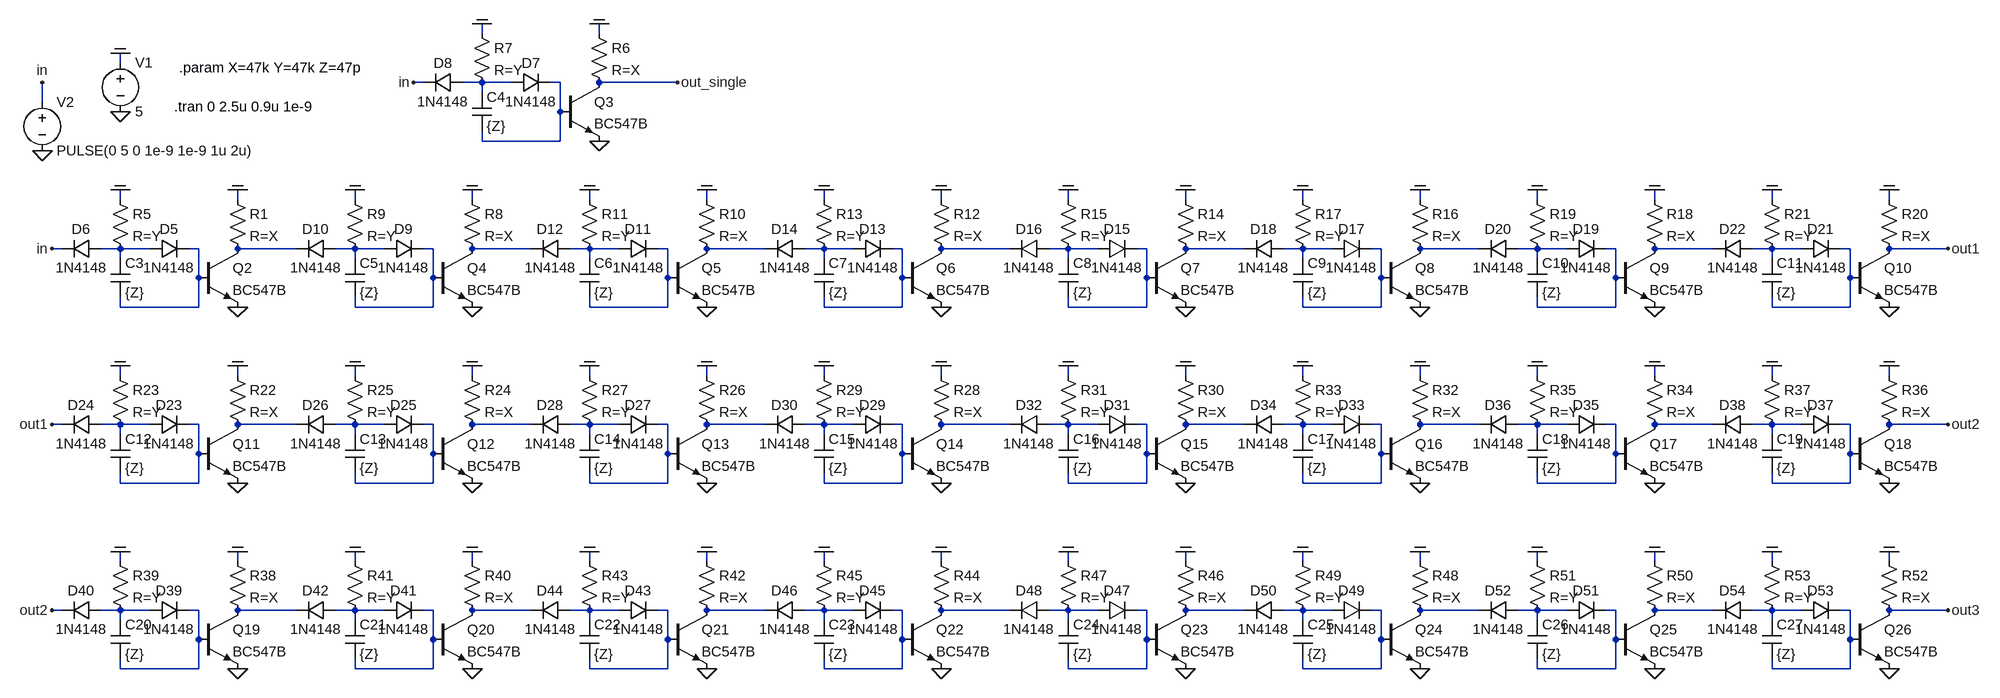
[diagram p0: schematic dtl_cap.asc]
dtl_cap.asc, the LTspice schematic file:
Version 4
SHEET 1 2948 1300
WIRE 480 240 480 224
WIRE 672 240 672 224
WIRE -112 288 -112 272
WIRE 384 320 368 320
WIRE 480 320 448 320
WIRE 528 320 480 320
WIRE 608 320 592 320
WIRE 800 320 672 320
WIRE 480 336 480 320
WIRE -240 352 -240 320
WIRE 608 368 608 320
WIRE 480 416 480 400
WIRE 608 416 608 368
WIRE 608 416 480 416
WIRE -112 512 -112 496
WIRE 80 512 80 496
WIRE 272 512 272 496
WIRE 464 512 464 496
WIRE 656 512 656 496
WIRE 848 512 848 496
WIRE 1040 512 1040 496
WIRE 1232 512 1232 496
WIRE 1440 512 1440 496
WIRE 1632 512 1632 496
WIRE 1824 512 1824 496
WIRE 2016 512 2016 496
WIRE 2208 512 2208 496
WIRE 2400 512 2400 496
WIRE 2592 512 2592 496
WIRE 2784 512 2784 496
WIRE -208 592 -224 592
WIRE -112 592 -144 592
WIRE -64 592 -112 592
WIRE 16 592 0 592
WIRE 176 592 80 592
WIRE 272 592 240 592
WIRE 320 592 272 592
WIRE 400 592 384 592
WIRE 560 592 464 592
WIRE 656 592 624 592
WIRE 704 592 656 592
WIRE 784 592 768 592
WIRE 944 592 848 592
WIRE 1040 592 1008 592
WIRE 1088 592 1040 592
WIRE 1168 592 1152 592
WIRE 1344 592 1232 592
WIRE 1440 592 1408 592
WIRE 1488 592 1440 592
WIRE 1568 592 1552 592
WIRE 1728 592 1632 592
WIRE 1824 592 1792 592
WIRE 1872 592 1824 592
WIRE 1952 592 1936 592
WIRE 2112 592 2016 592
WIRE 2208 592 2176 592
WIRE 2256 592 2208 592
WIRE 2336 592 2320 592
WIRE 2496 592 2400 592
WIRE 2592 592 2560 592
WIRE 2640 592 2592 592
WIRE 2720 592 2704 592
WIRE 2880 592 2784 592
WIRE -112 608 -112 592
WIRE 272 608 272 592
WIRE 656 608 656 592
WIRE 1040 608 1040 592
WIRE 1440 608 1440 592
WIRE 1824 608 1824 592
WIRE 2208 608 2208 592
WIRE 2592 608 2592 592
WIRE 16 640 16 592
WIRE 400 640 400 592
WIRE 784 640 784 592
WIRE 1168 640 1168 592
WIRE 1568 640 1568 592
WIRE 1952 640 1952 592
WIRE 2336 640 2336 592
WIRE 2720 640 2720 592
WIRE -112 688 -112 672
WIRE 16 688 16 640
WIRE 16 688 -112 688
WIRE 272 688 272 672
WIRE 400 688 400 640
WIRE 400 688 272 688
WIRE 656 688 656 672
WIRE 784 688 784 640
WIRE 784 688 656 688
WIRE 1040 688 1040 672
WIRE 1168 688 1168 640
WIRE 1168 688 1040 688
WIRE 1440 688 1440 672
WIRE 1568 688 1568 640
WIRE 1568 688 1440 688
WIRE 1824 688 1824 672
WIRE 1952 688 1952 640
WIRE 1952 688 1824 688
WIRE 2208 688 2208 672
WIRE 2336 688 2336 640
WIRE 2336 688 2208 688
WIRE 2592 688 2592 672
WIRE 2720 688 2720 640
WIRE 2720 688 2592 688
WIRE -112 800 -112 784
WIRE 80 800 80 784
WIRE 272 800 272 784
WIRE 464 800 464 784
WIRE 656 800 656 784
WIRE 848 800 848 784
WIRE 1040 800 1040 784
WIRE 1232 800 1232 784
WIRE 1440 800 1440 784
WIRE 1632 800 1632 784
WIRE 1824 800 1824 784
WIRE 2016 800 2016 784
WIRE 2208 800 2208 784
WIRE 2400 800 2400 784
WIRE 2592 800 2592 784
WIRE 2784 800 2784 784
WIRE -208 880 -224 880
WIRE -112 880 -144 880
WIRE -64 880 -112 880
WIRE 16 880 0 880
WIRE 176 880 80 880
WIRE 272 880 240 880
WIRE 320 880 272 880
WIRE 400 880 384 880
WIRE 560 880 464 880
WIRE 656 880 624 880
WIRE 704 880 656 880
WIRE 784 880 768 880
WIRE 944 880 848 880
WIRE 1040 880 1008 880
WIRE 1088 880 1040 880
WIRE 1168 880 1152 880
WIRE 1344 880 1232 880
WIRE 1440 880 1408 880
WIRE 1488 880 1440 880
WIRE 1568 880 1552 880
WIRE 1728 880 1632 880
WIRE 1824 880 1792 880
WIRE 1872 880 1824 880
WIRE 1952 880 1936 880
WIRE 2112 880 2016 880
WIRE 2208 880 2176 880
WIRE 2256 880 2208 880
WIRE 2336 880 2320 880
WIRE 2496 880 2400 880
WIRE 2592 880 2560 880
WIRE 2640 880 2592 880
WIRE 2720 880 2704 880
WIRE 2880 880 2784 880
WIRE -112 896 -112 880
WIRE 272 896 272 880
WIRE 656 896 656 880
WIRE 1040 896 1040 880
WIRE 1440 896 1440 880
WIRE 1824 896 1824 880
WIRE 2208 896 2208 880
WIRE 2592 896 2592 880
WIRE 16 928 16 880
WIRE 400 928 400 880
WIRE 784 928 784 880
WIRE 1168 928 1168 880
WIRE 1568 928 1568 880
WIRE 1952 928 1952 880
WIRE 2336 928 2336 880
WIRE 2720 928 2720 880
WIRE -112 976 -112 960
WIRE 16 976 16 928
WIRE 16 976 -112 976
WIRE 272 976 272 960
WIRE 400 976 400 928
WIRE 400 976 272 976
WIRE 656 976 656 960
WIRE 784 976 784 928
WIRE 784 976 656 976
WIRE 1040 976 1040 960
WIRE 1168 976 1168 928
WIRE 1168 976 1040 976
WIRE 1440 976 1440 960
WIRE 1568 976 1568 928
WIRE 1568 976 1440 976
WIRE 1824 976 1824 960
WIRE 1952 976 1952 928
WIRE 1952 976 1824 976
WIRE 2208 976 2208 960
WIRE 2336 976 2336 928
WIRE 2336 976 2208 976
WIRE 2592 976 2592 960
WIRE 2720 976 2720 928
WIRE 2720 976 2592 976
WIRE -112 1104 -112 1088
WIRE 80 1104 80 1088
WIRE 272 1104 272 1088
WIRE 464 1104 464 1088
WIRE 656 1104 656 1088
WIRE 848 1104 848 1088
WIRE 1040 1104 1040 1088
WIRE 1232 1104 1232 1088
WIRE 1440 1104 1440 1088
WIRE 1632 1104 1632 1088
WIRE 1824 1104 1824 1088
WIRE 2016 1104 2016 1088
WIRE 2208 1104 2208 1088
WIRE 2400 1104 2400 1088
WIRE 2592 1104 2592 1088
WIRE 2784 1104 2784 1088
WIRE -208 1184 -224 1184
WIRE -112 1184 -144 1184
WIRE -64 1184 -112 1184
WIRE 16 1184 0 1184
WIRE 176 1184 80 1184
WIRE 272 1184 240 1184
WIRE 320 1184 272 1184
WIRE 400 1184 384 1184
WIRE 560 1184 464 1184
WIRE 656 1184 624 1184
WIRE 704 1184 656 1184
WIRE 784 1184 768 1184
WIRE 944 1184 848 1184
WIRE 1040 1184 1008 1184
WIRE 1088 1184 1040 1184
WIRE 1168 1184 1152 1184
WIRE 1344 1184 1232 1184
WIRE 1440 1184 1408 1184
WIRE 1488 1184 1440 1184
WIRE 1568 1184 1552 1184
WIRE 1728 1184 1632 1184
WIRE 1824 1184 1792 1184
WIRE 1872 1184 1824 1184
WIRE 1952 1184 1936 1184
WIRE 2112 1184 2016 1184
WIRE 2208 1184 2176 1184
WIRE 2256 1184 2208 1184
WIRE 2336 1184 2320 1184
WIRE 2496 1184 2400 1184
WIRE 2592 1184 2560 1184
WIRE 2640 1184 2592 1184
WIRE 2720 1184 2704 1184
WIRE 2880 1184 2784 1184
WIRE -112 1200 -112 1184
WIRE 272 1200 272 1184
WIRE 656 1200 656 1184
WIRE 1040 1200 1040 1184
WIRE 1440 1200 1440 1184
WIRE 1824 1200 1824 1184
WIRE 2208 1200 2208 1184
WIRE 2592 1200 2592 1184
WIRE 16 1232 16 1184
WIRE 400 1232 400 1184
WIRE 784 1232 784 1184
WIRE 1168 1232 1168 1184
WIRE 1568 1232 1568 1184
WIRE 1952 1232 1952 1184
WIRE 2336 1232 2336 1184
WIRE 2720 1232 2720 1184
WIRE -112 1280 -112 1264
WIRE 16 1280 16 1232
WIRE 16 1280 -112 1280
WIRE 272 1280 272 1264
WIRE 400 1280 400 1232
WIRE 400 1280 272 1280
WIRE 656 1280 656 1264
WIRE 784 1280 784 1232
WIRE 784 1280 656 1280
WIRE 1040 1280 1040 1264
WIRE 1168 1280 1168 1232
WIRE 1168 1280 1040 1280
WIRE 1440 1280 1440 1264
WIRE 1568 1280 1568 1232
WIRE 1568 1280 1440 1280
WIRE 1824 1280 1824 1264
WIRE 1952 1280 1952 1232
WIRE 1952 1280 1824 1280
WIRE 2208 1280 2208 1264
WIRE 2336 1280 2336 1232
WIRE 2336 1280 2208 1280
WIRE 2592 1280 2592 1264
WIRE 2720 1280 2720 1232
WIRE 2720 1280 2592 1280
FLAG -112 368 0
FLAG -112 272 COM
FLAG -240 432 0
FLAG -240 320 in
FLAG 80 688 0
FLAG 80 496 COM
FLAG -112 496 COM
FLAG 672 416 0
FLAG 672 224 COM
FLAG 480 224 COM
FLAG 464 688 0
FLAG 464 496 COM
FLAG 272 496 COM
FLAG 848 688 0
FLAG 848 496 COM
FLAG 656 496 COM
FLAG 1232 688 0
FLAG 1232 496 COM
FLAG 1040 496 COM
FLAG 1632 688 0
FLAG 1632 496 COM
FLAG 1440 496 COM
FLAG 2016 688 0
FLAG 2016 496 COM
FLAG 1824 496 COM
FLAG 2400 688 0
FLAG 2400 496 COM
FLAG 2208 496 COM
FLAG 2784 688 0
FLAG 2784 496 COM
FLAG 2592 496 COM
FLAG 80 976 0
FLAG 80 784 COM
FLAG -112 784 COM
FLAG 464 976 0
FLAG 464 784 COM
FLAG 272 784 COM
FLAG 848 976 0
FLAG 848 784 COM
FLAG 656 784 COM
FLAG 1232 976 0
FLAG 1232 784 COM
FLAG 1040 784 COM
FLAG 1632 976 0
FLAG 1632 784 COM
FLAG 1440 784 COM
FLAG 2016 976 0
FLAG 2016 784 COM
FLAG 1824 784 COM
FLAG 2400 976 0
FLAG 2400 784 COM
FLAG 2208 784 COM
FLAG 2784 976 0
FLAG 2784 784 COM
FLAG 2592 784 COM
FLAG 80 1280 0
FLAG 80 1088 COM
FLAG -112 1088 COM
FLAG 464 1280 0
FLAG 464 1088 COM
FLAG 272 1088 COM
FLAG 848 1280 0
FLAG 848 1088 COM
FLAG 656 1088 COM
FLAG 1232 1280 0
FLAG 1232 1088 COM
FLAG 1040 1088 COM
FLAG 1632 1280 0
FLAG 1632 1088 COM
FLAG 1440 1088 COM
FLAG 2016 1280 0
FLAG 2016 1088 COM
FLAG 1824 1088 COM
FLAG 2400 1280 0
FLAG 2400 1088 COM
FLAG 2208 1088 COM
FLAG 2784 1280 0
FLAG 2784 1088 COM
FLAG 2592 1088 COM
FLAG -224 592 in
FLAG 2880 592 out1
FLAG -224 880 out1
FLAG 2880 880 out2
FLAG -224 1184 out2
FLAG 2880 1184 out3
FLAG 368 320 in
FLAG 800 320 out_single
SYMBOL voltage -112 272 R0
WINDOW 123 0 0 Left 2
WINDOW 39 0 0 Left 2
SYMATTR InstName V1
SYMATTR Value 5
SYMBOL voltage -240 336 R0
WINDOW 123 0 0 Left 2
WINDOW 39 0 0 Left 2
SYMATTR InstName V2
SYMATTR Value PULSE(0 5 0 1e-9 1e-9 1u 2u)
SYMBOL npn 16 592 R0
SYMATTR InstName Q2
SYMATTR Value BC547B
SYMBOL res 64 496 R0
SYMATTR InstName R1
SYMATTR Value R=X
SYMBOL diode -64 608 R270
WINDOW 0 32 32 VTop 2
WINDOW 3 0 32 VBottom 2
SYMATTR InstName D5
SYMATTR Value 1N4148
SYMBOL diode -144 576 R90
WINDOW 0 0 32 VBottom 2
WINDOW 3 32 32 VTop 2
SYMATTR InstName D6
SYMATTR Value 1N4148
SYMBOL res -128 496 R0
SYMATTR InstName R5
SYMATTR Value R=Y
SYMBOL cap -128 608 R0
SYMATTR InstName C3
SYMATTR Value {Z}
SYMBOL npn 608 320 R0
SYMATTR InstName Q3
SYMATTR Value BC547B
SYMBOL res 656 224 R0
SYMATTR InstName R6
SYMATTR Value R=X
SYMBOL diode 528 336 R270
WINDOW 0 32 32 VTop 2
WINDOW 3 0 32 VBottom 2
SYMATTR InstName D7
SYMATTR Value 1N4148
SYMBOL diode 448 304 R90
WINDOW 0 0 32 VBottom 2
WINDOW 3 32 32 VTop 2
SYMATTR InstName D8
SYMATTR Value 1N4148
SYMBOL res 464 224 R0
SYMATTR InstName R7
SYMATTR Value R=Y
SYMBOL cap 464 336 R0
SYMATTR InstName C4
SYMATTR Value {Z}
SYMBOL npn 400 592 R0
SYMATTR InstName Q4
SYMATTR Value BC547B
SYMBOL res 448 496 R0
SYMATTR InstName R8
SYMATTR Value R=X
SYMBOL diode 320 608 R270
WINDOW 0 32 32 VTop 2
WINDOW 3 0 32 VBottom 2
SYMATTR InstName D9
SYMATTR Value 1N4148
SYMBOL diode 240 576 R90
WINDOW 0 0 32 VBottom 2
WINDOW 3 32 32 VTop 2
SYMATTR InstName D10
SYMATTR Value 1N4148
SYMBOL res 256 496 R0
SYMATTR InstName R9
SYMATTR Value R=Y
SYMBOL cap 256 608 R0
SYMATTR InstName C5
SYMATTR Value {Z}
SYMBOL npn 784 592 R0
SYMATTR InstName Q5
SYMATTR Value BC547B
SYMBOL res 832 496 R0
SYMATTR InstName R10
SYMATTR Value R=X
SYMBOL diode 704 608 R270
WINDOW 0 32 32 VTop 2
WINDOW 3 0 32 VBottom 2
SYMATTR InstName D11
SYMATTR Value 1N4148
SYMBOL diode 624 576 R90
WINDOW 0 0 32 VBottom 2
WINDOW 3 32 32 VTop 2
SYMATTR InstName D12
SYMATTR Value 1N4148
SYMBOL res 640 496 R0
SYMATTR InstName R11
SYMATTR Value R=Y
SYMBOL cap 640 608 R0
SYMATTR InstName C6
SYMATTR Value {Z}
SYMBOL npn 1168 592 R0
SYMATTR InstName Q6
SYMATTR Value BC547B
SYMBOL res 1216 496 R0
SYMATTR InstName R12
SYMATTR Value R=X
SYMBOL diode 1088 608 R270
WINDOW 0 32 32 VTop 2
WINDOW 3 0 32 VBottom 2
SYMATTR InstName D13
SYMATTR Value 1N4148
SYMBOL diode 1008 576 R90
WINDOW 0 0 32 VBottom 2
WINDOW 3 32 32 VTop 2
SYMATTR InstName D14
SYMATTR Value 1N4148
SYMBOL res 1024 496 R0
SYMATTR InstName R13
SYMATTR Value R=Y
SYMBOL cap 1024 608 R0
SYMATTR InstName C7
SYMATTR Value {Z}
SYMBOL npn 1568 592 R0
SYMATTR InstName Q7
SYMATTR Value BC547B
SYMBOL res 1616 496 R0
SYMATTR InstName R14
SYMATTR Value R=X
SYMBOL diode 1488 608 R270
WINDOW 0 32 32 VTop 2
WINDOW 3 0 32 VBottom 2
SYMATTR InstName D15
SYMATTR Value 1N4148
SYMBOL diode 1408 576 R90
WINDOW 0 0 32 VBottom 2
WINDOW 3 32 32 VTop 2
SYMATTR InstName D16
SYMATTR Value 1N4148
SYMBOL res 1424 496 R0
SYMATTR InstName R15
SYMATTR Value R=Y
SYMBOL cap 1424 608 R0
SYMATTR InstName C8
SYMATTR Value {Z}
SYMBOL npn 1952 592 R0
SYMATTR InstName Q8
SYMATTR Value BC547B
SYMBOL res 2000 496 R0
SYMATTR InstName R16
SYMATTR Value R=X
SYMBOL diode 1872 608 R270
WINDOW 0 32 32 VTop 2
WINDOW 3 0 32 VBottom 2
SYMATTR InstName D17
SYMATTR Value 1N4148
SYMBOL diode 1792 576 R90
WINDOW 0 0 32 VBottom 2
WINDOW 3 32 32 VTop 2
SYMATTR InstName D18
SYMATTR Value 1N4148
SYMBOL res 1808 496 R0
SYMATTR InstName R17
SYMATTR Value R=Y
SYMBOL cap 1808 608 R0
SYMATTR InstName C9
SYMATTR Value {Z}
SYMBOL npn 2336 592 R0
SYMATTR InstName Q9
SYMATTR Value BC547B
SYMBOL res 2384 496 R0
SYMATTR InstName R18
SYMATTR Value R=X
SYMBOL diode 2256 608 R270
WINDOW 0 32 32 VTop 2
WINDOW 3 0 32 VBottom 2
SYMATTR InstName D19
SYMATTR Value 1N4148
SYMBOL diode 2176 576 R90
WINDOW 0 0 32 VBottom 2
WINDOW 3 32 32 VTop 2
SYMATTR InstName D20
SYMATTR Value 1N4148
SYMBOL res 2192 496 R0
SYMATTR InstName R19
SYMATTR Value R=Y
SYMBOL cap 2192 608 R0
SYMATTR InstName C10
SYMATTR Value {Z}
SYMBOL npn 2720 592 R0
SYMATTR InstName Q10
SYMATTR Value BC547B
SYMBOL res 2768 496 R0
SYMATTR InstName R20
SYMATTR Value R=X
SYMBOL diode 2640 608 R270
WINDOW 0 32 32 VTop 2
WINDOW 3 0 32 VBottom 2
SYMATTR InstName D21
SYMATTR Value 1N4148
SYMBOL diode 2560 576 R90
WINDOW 0 0 32 VBottom 2
WINDOW 3 32 32 VTop 2
SYMATTR InstName D22
SYMATTR Value 1N4148
SYMBOL res 2576 496 R0
SYMATTR InstName R21
SYMATTR Value R=Y
SYMBOL cap 2576 608 R0
SYMATTR InstName C11
SYMATTR Value {Z}
SYMBOL npn 16 880 R0
SYMATTR InstName Q11
SYMATTR Value BC547B
SYMBOL res 64 784 R0
SYMATTR InstName R22
SYMATTR Value R=X
SYMBOL diode -64 896 R270
WINDOW 0 32 32 VTop 2
WINDOW 3 0 32 VBottom 2
SYMATTR InstName D23
SYMATTR Value 1N4148
SYMBOL diode -144 864 R90
WINDOW 0 0 32 VBottom 2
WINDOW 3 32 32 VTop 2
SYMATTR InstName D24
SYMATTR Value 1N4148
SYMBOL res -128 784 R0
SYMATTR InstName R23
SYMATTR Value R=Y
SYMBOL cap -128 896 R0
SYMATTR InstName C12
SYMATTR Value {Z}
SYMBOL npn 400 880 R0
SYMATTR InstName Q12
SYMATTR Value BC547B
SYMBOL res 448 784 R0
SYMATTR InstName R24
SYMATTR Value R=X
SYMBOL diode 320 896 R270
WINDOW 0 32 32 VTop 2
WINDOW 3 0 32 VBottom 2
SYMATTR InstName D25
SYMATTR Value 1N4148
SYMBOL diode 240 864 R90
WINDOW 0 0 32 VBottom 2
WINDOW 3 32 32 VTop 2
SYMATTR InstName D26
SYMATTR Value 1N4148
SYMBOL res 256 784 R0
SYMATTR InstName R25
SYMATTR Value R=Y
SYMBOL cap 256 896 R0
SYMATTR InstName C13
SYMATTR Value {Z}
SYMBOL npn 784 880 R0
SYMATTR InstName Q13
SYMATTR Value BC547B
SYMBOL res 832 784 R0
SYMATTR InstName R26
SYMATTR Value R=X
SYMBOL diode 704 896 R270
WINDOW 0 32 32 VTop 2
WINDOW 3 0 32 VBottom 2
SYMATTR InstName D27
SYMATTR Value 1N4148
SYMBOL diode 624 864 R90
WINDOW 0 0 32 VBottom 2
WINDOW 3 32 32 VTop 2
SYMATTR InstName D28
SYMATTR Value 1N4148
SYMBOL res 640 784 R0
SYMATTR InstName R27
SYMATTR Value R=Y
SYMBOL cap 640 896 R0
SYMATTR InstName C14
SYMATTR Value {Z}
SYMBOL npn 1168 880 R0
SYMATTR InstName Q14
SYMATTR Value BC547B
SYMBOL res 1216 784 R0
SYMATTR InstName R28
SYMATTR Value R=X
SYMBOL diode 1088 896 R270
WINDOW 0 32 32 VTop 2
WINDOW 3 0 32 VBottom 2
SYMATTR InstName D29
SYMATTR Value 1N4148
SYMBOL diode 1008 864 R90
WINDOW 0 0 32 VBottom 2
WINDOW 3 32 32 VTop 2
SYMATTR InstName D30
SYMATTR Value 1N4148
SYMBOL res 1024 784 R0
SYMATTR InstName R29
SYMATTR Value R=Y
SYMBOL cap 1024 896 R0
SYMATTR InstName C15
SYMATTR Value {Z}
SYMBOL npn 1568 880 R0
SYMATTR InstName Q15
SYMATTR Value BC547B
SYMBOL res 1616 784 R0
SYMATTR InstName R30
SYMATTR Value R=X
SYMBOL diode 1488 896 R270
WINDOW 0 32 32 VTop 2
WINDOW 3 0 32 VBottom 2
SYMATTR InstName D31
SYMATTR Value 1N4148
SYMBOL diode 1408 864 R90
WINDOW 0 0 32 VBottom 2
WINDOW 3 32 32 VTop 2
SYMATTR InstName D32
SYMATTR Value 1N4148
SYMBOL res 1424 784 R0
SYMATTR InstName R31
SYMATTR Value R=Y
SYMBOL cap 1424 896 R0
SYMATTR InstName C16
SYMATTR Value {Z}
SYMBOL npn 1952 880 R0
SYMATTR InstName Q16
SYMATTR Value BC547B
SYMBOL res 2000 784 R0
SYMATTR InstName R32
SYMATTR Value R=X
SYMBOL diode 1872 896 R270
WINDOW 0 32 32 VTop 2
WINDOW 3 0 32 VBottom 2
SYMATTR InstName D33
SYMATTR Value 1N4148
SYMBOL diode 1792 864 R90
WINDOW 0 0 32 VBottom 2
WINDOW 3 32 32 VTop 2
SYMATTR InstName D34
SYMATTR Value 1N4148
SYMBOL res 1808 784 R0
SYMATTR InstName R33
SYMATTR Value R=Y
SYMBOL cap 1808 896 R0
SYMATTR InstName C17
SYMATTR Value {Z}
SYMBOL npn 2336 880 R0
SYMATTR InstName Q17
SYMATTR Value BC547B
SYMBOL res 2384 784 R0
SYMATTR InstName R34
SYMATTR Value R=X
SYMBOL diode 2256 896 R270
WINDOW 0 32 32 VTop 2
WINDOW 3 0 32 VBottom 2
SYMATTR InstName D35
SYMATTR Value 1N4148
SYMBOL diode 2176 864 R90
WINDOW 0 0 32 VBottom 2
WINDOW 3 32 32 VTop 2
SYMATTR InstName D36
SYMATTR Value 1N4148
SYMBOL res 2192 784 R0
SYMATTR InstName R35
SYMATTR Value R=Y
SYMBOL cap 2192 896 R0
SYMATTR InstName C18
SYMATTR Value {Z}
SYMBOL npn 2720 880 R0
SYMATTR InstName Q18
SYMATTR Value BC547B
SYMBOL res 2768 784 R0
SYMATTR InstName R36
SYMATTR Value R=X
SYMBOL diode 2640 896 R270
WINDOW 0 32 32 VTop 2
WINDOW 3 0 32 VBottom 2
SYMATTR InstName D37
SYMATTR Value 1N4148
SYMBOL diode 2560 864 R90
WINDOW 0 0 32 VBottom 2
WINDOW 3 32 32 VTop 2
SYMATTR InstName D38
SYMATTR Value 1N4148
SYMBOL res 2576 784 R0
SYMATTR InstName R37
SYMATTR Value R=Y
SYMBOL cap 2576 896 R0
SYMATTR InstName C19
SYMATTR Value {Z}
SYMBOL npn 16 1184 R0
SYMATTR InstName Q19
SYMATTR Value BC547B
SYMBOL res 64 1088 R0
SYMATTR InstName R38
SYMATTR Value R=X
SYMBOL diode -64 1200 R270
WINDOW 0 32 32 VTop 2
WINDOW 3 0 32 VBottom 2
SYMATTR InstName D39
SYMATTR Value 1N4148
SYMBOL diode -144 1168 R90
WINDOW 0 0 32 VBottom 2
WINDOW 3 32 32 VTop 2
SYMATTR InstName D40
SYMATTR Value 1N4148
SYMBOL res -128 1088 R0
SYMATTR InstName R39
SYMATTR Value R=Y
SYMBOL cap -128 1200 R0
SYMATTR InstName C20
SYMATTR Value {Z}
SYMBOL npn 400 1184 R0
SYMATTR InstName Q20
SYMATTR Value BC547B
SYMBOL res 448 1088 R0
SYMATTR InstName R40
SYMATTR Value R=X
SYMBOL diode 320 1200 R270
WINDOW 0 32 32 VTop 2
WINDOW 3 0 32 VBottom 2
SYMATTR InstName D41
SYMATTR Value 1N4148
SYMBOL diode 240 1168 R90
WINDOW 0 0 32 VBottom 2
WINDOW 3 32 32 VTop 2
SYMATTR InstName D42
SYMATTR Value 1N4148
SYMBOL res 256 1088 R0
SYMATTR InstName R41
SYMATTR Value R=Y
SYMBOL cap 256 1200 R0
SYMATTR InstName C21
SYMATTR Value {Z}
SYMBOL npn 784 1184 R0
SYMATTR InstName Q21
SYMATTR Value BC547B
SYMBOL res 832 1088 R0
SYMATTR InstName R42
SYMATTR Value R=X
SYMBOL diode 704 1200 R270
WINDOW 0 32 32 VTop 2
WINDOW 3 0 32 VBottom 2
SYMATTR InstName D43
SYMATTR Value 1N4148
SYMBOL diode 624 1168 R90
WINDOW 0 0 32 VBottom 2
WINDOW 3 32 32 VTop 2
SYMATTR InstName D44
SYMATTR Value 1N4148
SYMBOL res 640 1088 R0
SYMATTR InstName R43
SYMATTR Value R=Y
SYMBOL cap 640 1200 R0
SYMATTR InstName C22
SYMATTR Value {Z}
SYMBOL npn 1168 1184 R0
SYMATTR InstName Q22
SYMATTR Value BC547B
SYMBOL res 1216 1088 R0
SYMATTR InstName R44
SYMATTR Value R=X
SYMBOL diode 1088 1200 R270
WINDOW 0 32 32 VTop 2
WINDOW 3 0 32 VBottom 2
SYMATTR InstName D45
SYMATTR Value 1N4148
SYMBOL diode 1008 1168 R90
WINDOW 0 0 32 VBottom 2
WINDOW 3 32 32 VTop 2
SYMATTR InstName D46
SYMATTR Value 1N4148
SYMBOL res 1024 1088 R0
SYMATTR InstName R45
SYMATTR Value R=Y
SYMBOL cap 1024 1200 R0
SYMATTR InstName C23
SYMATTR Value {Z}
SYMBOL npn 1568 1184 R0
SYMATTR InstName Q23
SYMATTR Value BC547B
SYMBOL res 1616 1088 R0
SYMATTR InstName R46
SYMATTR Value R=X
SYMBOL diode 1488 1200 R270
WINDOW 0 32 32 VTop 2
WINDOW 3 0 32 VBottom 2
SYMATTR InstName D47
SYMATTR Value 1N4148
SYMBOL diode 1408 1168 R90
WINDOW 0 0 32 VBottom 2
WINDOW 3 32 32 VTop 2
SYMATTR InstName D48
SYMATTR Value 1N4148
SYMBOL res 1424 1088 R0
SYMATTR InstName R47
SYMATTR Value R=Y
SYMBOL cap 1424 1200 R0
SYMATTR InstName C24
SYMATTR Value {Z}
SYMBOL npn 1952 1184 R0
SYMATTR InstName Q24
SYMATTR Value BC547B
SYMBOL res 2000 1088 R0
SYMATTR InstName R48
SYMATTR Value R=X
SYMBOL diode 1872 1200 R270
WINDOW 0 32 32 VTop 2
WINDOW 3 0 32 VBottom 2
SYMATTR InstName D49
SYMATTR Value 1N4148
SYMBOL diode 1792 1168 R90
WINDOW 0 0 32 VBottom 2
WINDOW 3 32 32 VTop 2
SYMATTR InstName D50
SYMATTR Value 1N4148
SYMBOL res 1808 1088 R0
SYMATTR InstName R49
SYMATTR Value R=Y
SYMBOL cap 1808 1200 R0
SYMATTR InstName C25
SYMATTR Value {Z}
SYMBOL npn 2336 1184 R0
SYMATTR InstName Q25
SYMATTR Value BC547B
SYMBOL res 2384 1088 R0
SYMATTR InstName R50
SYMATTR Value R=X
SYMBOL diode 2256 1200 R270
WINDOW 0 32 32 VTop 2
WINDOW 3 0 32 VBottom 2
SYMATTR InstName D51
SYMATTR Value 1N4148
SYMBOL diode 2176 1168 R90
WINDOW 0 0 32 VBottom 2
WINDOW 3 32 32 VTop 2
SYMATTR InstName D52
SYMATTR Value 1N4148
SYMBOL res 2192 1088 R0
SYMATTR InstName R51
SYMATTR Value R=Y
SYMBOL cap 2192 1200 R0
SYMATTR InstName C26
SYMATTR Value {Z}
SYMBOL npn 2720 1184 R0
SYMATTR InstName Q26
SYMATTR Value BC547B
SYMBOL res 2768 1088 R0
SYMATTR InstName R52
SYMATTR Value R=X
SYMBOL diode 2640 1200 R270
WINDOW 0 32 32 VTop 2
WINDOW 3 0 32 VBottom 2
SYMATTR InstName D53
SYMATTR Value 1N4148
SYMBOL diode 2560 1168 R90
WINDOW 0 0 32 VBottom 2
WINDOW 3 32 32 VTop 2
SYMATTR InstName D54
SYMATTR Value 1N4148
SYMBOL res 2576 1088 R0
SYMATTR InstName R53
SYMATTR Value R=Y
SYMBOL cap 2576 1200 R0
SYMATTR InstName C27
SYMATTR Value {Z}
TEXT -24 360 Left 2 !.tran 0 2.5u 0.9u 1e-9
TEXT -16 296 Left 2 !.param X=47k Y=47k Z=47p

The netlist it stands for:
* dtl_cap.asc
V1 COM 0 5
V2 in 0 PULSE(0 5 0 1e-9 1e-9 1u 2u)
Q2 N005 N004 0 0 BC547B
R1 COM N005 R=X
D5 N003 N004 1N4148
D6 N003 in 1N4148
R5 COM N003 R=Y
C3 N003 N004 {Z}
Q3 out_single N002 0 0 BC547B
R6 COM out_single R=X
D7 N001 N002 1N4148
D8 N001 in 1N4148
R7 COM N001 R=Y
C4 N001 N002 {Z}
Q4 N008 N007 0 0 BC547B
R8 COM N008 R=X
D9 N006 N007 1N4148
D10 N006 N005 1N4148
R9 COM N006 R=Y
C5 N006 N007 {Z}
Q5 N011 N010 0 0 BC547B
R10 COM N011 R=X
D11 N009 N010 1N4148
D12 N009 N008 1N4148
R11 COM N009 R=Y
C6 N009 N010 {Z}
Q6 N014 N013 0 0 BC547B
R12 COM N014 R=X
D13 N012 N013 1N4148
D14 N012 N011 1N4148
R13 COM N012 R=Y
C7 N012 N013 {Z}
Q7 N017 N016 0 0 BC547B
R14 COM N017 R=X
D15 N015 N016 1N4148
D16 N015 N014 1N4148
R15 COM N015 R=Y
C8 N015 N016 {Z}
Q8 N020 N019 0 0 BC547B
R16 COM N020 R=X
D17 N018 N019 1N4148
D18 N018 N017 1N4148
R17 COM N018 R=Y
C9 N018 N019 {Z}
Q9 N023 N022 0 0 BC547B
R18 COM N023 R=X
D19 N021 N022 1N4148
D20 N021 N020 1N4148
R19 COM N021 R=Y
C10 N021 N022 {Z}
Q10 out1 N025 0 0 BC547B
R20 COM out1 R=X
D21 N024 N025 1N4148
D22 N024 N023 1N4148
R21 COM N024 R=Y
C11 N024 N025 {Z}
Q11 N028 N027 0 0 BC547B
R22 COM N028 R=X
D23 N026 N027 1N4148
D24 N026 out1 1N4148
R23 COM N026 R=Y
C12 N026 N027 {Z}
Q12 N031 N030 0 0 BC547B
R24 COM N031 R=X
D25 N029 N030 1N4148
D26 N029 N028 1N4148
R25 COM N029 R=Y
C13 N029 N030 {Z}
Q13 N034 N033 0 0 BC547B
R26 COM N034 R=X
D27 N032 N033 1N4148
D28 N032 N031 1N4148
R27 COM N032 R=Y
C14 N032 N033 {Z}
Q14 N037 N036 0 0 BC547B
R28 COM N037 R=X
D29 N035 N036 1N4148
D30 N035 N034 1N4148
R29 COM N035 R=Y
C15 N035 N036 {Z}
Q15 N040 N039 0 0 BC547B
R30 COM N040 R=X
D31 N038 N039 1N4148
D32 N038 N037 1N4148
R31 COM N038 R=Y
C16 N038 N039 {Z}
Q16 N043 N042 0 0 BC547B
R32 COM N043 R=X
D33 N041 N042 1N4148
D34 N041 N040 1N4148
R33 COM N041 R=Y
C17 N041 N042 {Z}
Q17 N046 N045 0 0 BC547B
R34 COM N046 R=X
D35 N044 N045 1N4148
D36 N044 N043 1N4148
R35 COM N044 R=Y
C18 N044 N045 {Z}
Q18 out2 N048 0 0 BC547B
R36 COM out2 R=X
D37 N047 N048 1N4148
D38 N047 N046 1N4148
R37 COM N047 R=Y
C19 N047 N048 {Z}
Q19 N051 N050 0 0 BC547B
R38 COM N051 R=X
D39 N049 N050 1N4148
D40 N049 out2 1N4148
R39 COM N049 R=Y
C20 N049 N050 {Z}
Q20 N054 N053 0 0 BC547B
R40 COM N054 R=X
D41 N052 N053 1N4148
D42 N052 N051 1N4148
R41 COM N052 R=Y
C21 N052 N053 {Z}
Q21 N057 N056 0 0 BC547B
R42 COM N057 R=X
D43 N055 N056 1N4148
D44 N055 N054 1N4148
R43 COM N055 R=Y
C22 N055 N056 {Z}
Q22 N060 N059 0 0 BC547B
R44 COM N060 R=X
D45 N058 N059 1N4148
D46 N058 N057 1N4148
R45 COM N058 R=Y
C23 N058 N059 {Z}
Q23 N063 N062 0 0 BC547B
R46 COM N063 R=X
D47 N061 N062 1N4148
D48 N061 N060 1N4148
R47 COM N061 R=Y
C24 N061 N062 {Z}
Q24 N066 N065 0 0 BC547B
R48 COM N066 R=X
D49 N064 N065 1N4148
D50 N064 N063 1N4148
R49 COM N064 R=Y
C25 N064 N065 {Z}
Q25 N069 N068 0 0 BC547B
R50 COM N069 R=X
D51 N067 N068 1N4148
D52 N067 N066 1N4148
R51 COM N067 R=Y
C26 N067 N068 {Z}
Q26 out3 N071 0 0 BC547B
R52 COM out3 R=X
D53 N070 N071 1N4148
D54 N070 N069 1N4148
R53 COM N070 R=Y
C27 N070 N071 {Z}
.model D D
.lib standard.dio
.model NPN NPN
.model PNP PNP
.lib standard.bjt
.tran 0 2.5u 0.9u 1e-9
.param X=47k Y=47k Z=47p
.backanno
.end